# EasyEDA schematic SCH_LEDChaser_2025-10-19.json

## Sheets
1 Sheet_1: TITLE: Sheet_1; REV: 1.0; Date: 2025-10-19; Sheet: 1/1; Drawn By: cqnl; Company: Your Company
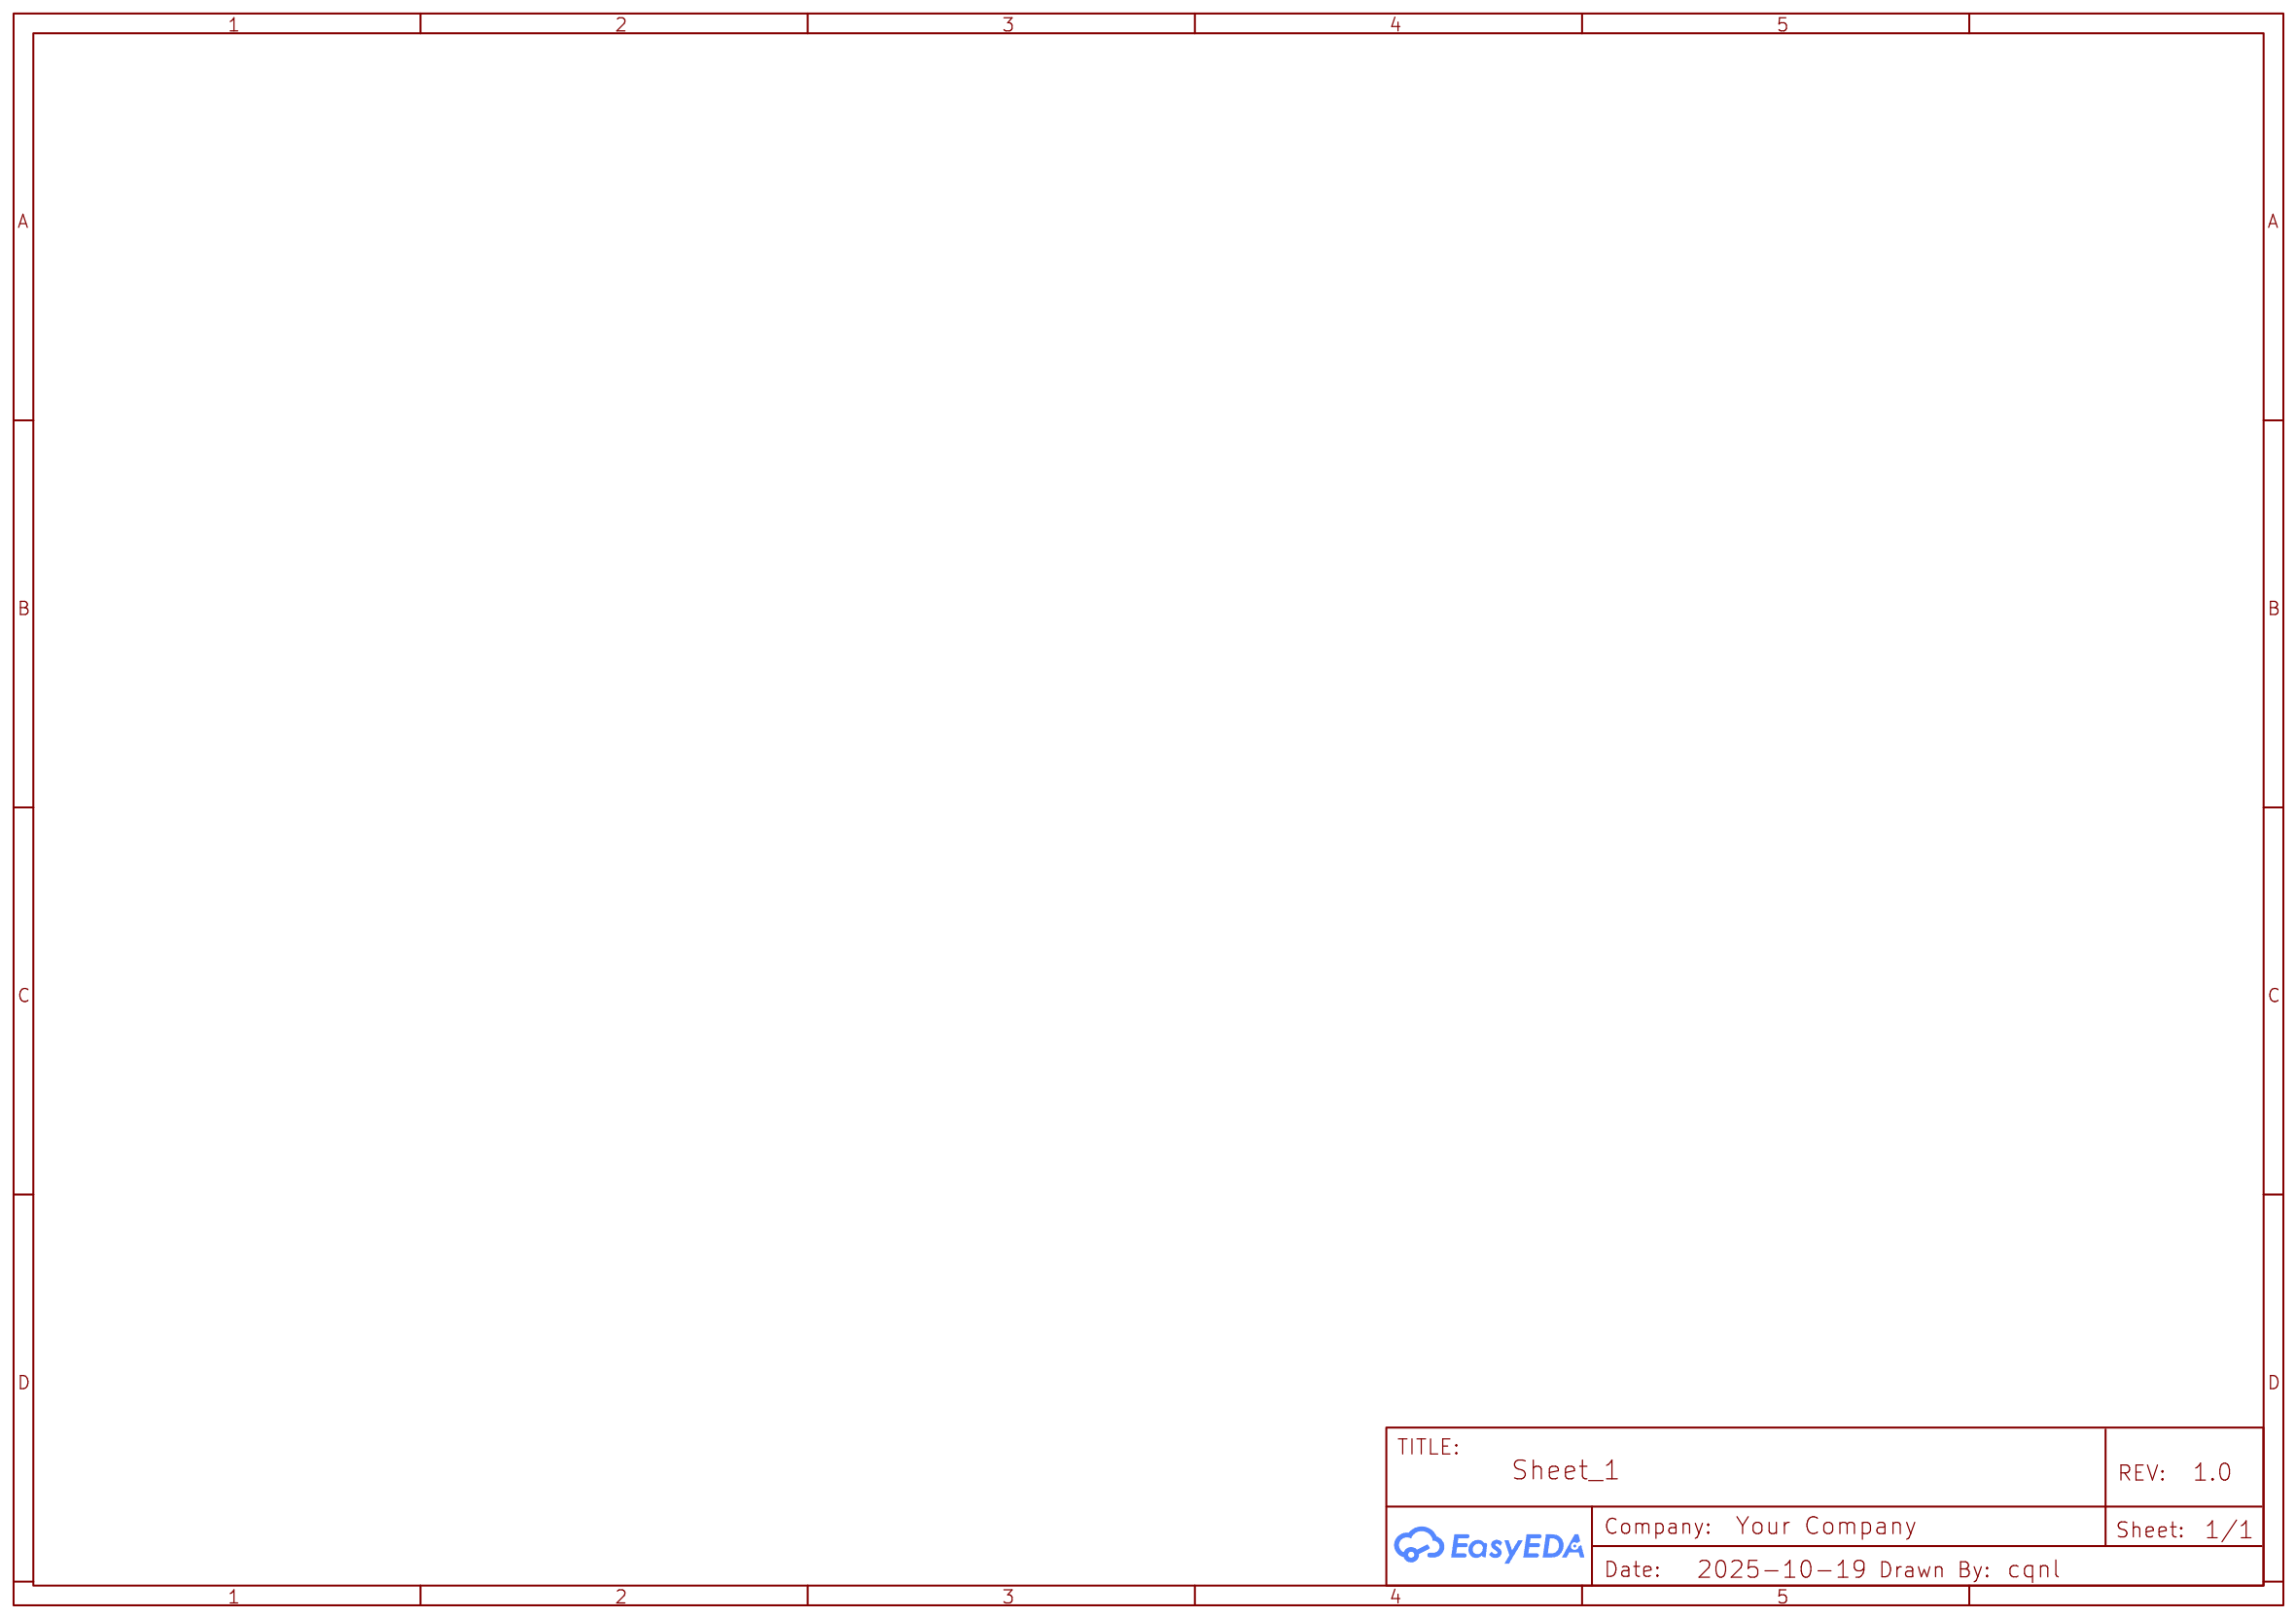
[diagram p0: Sheet_1]
2 LED Lab Components: Date: 2025-02-25; Drawn By: johncohnvt
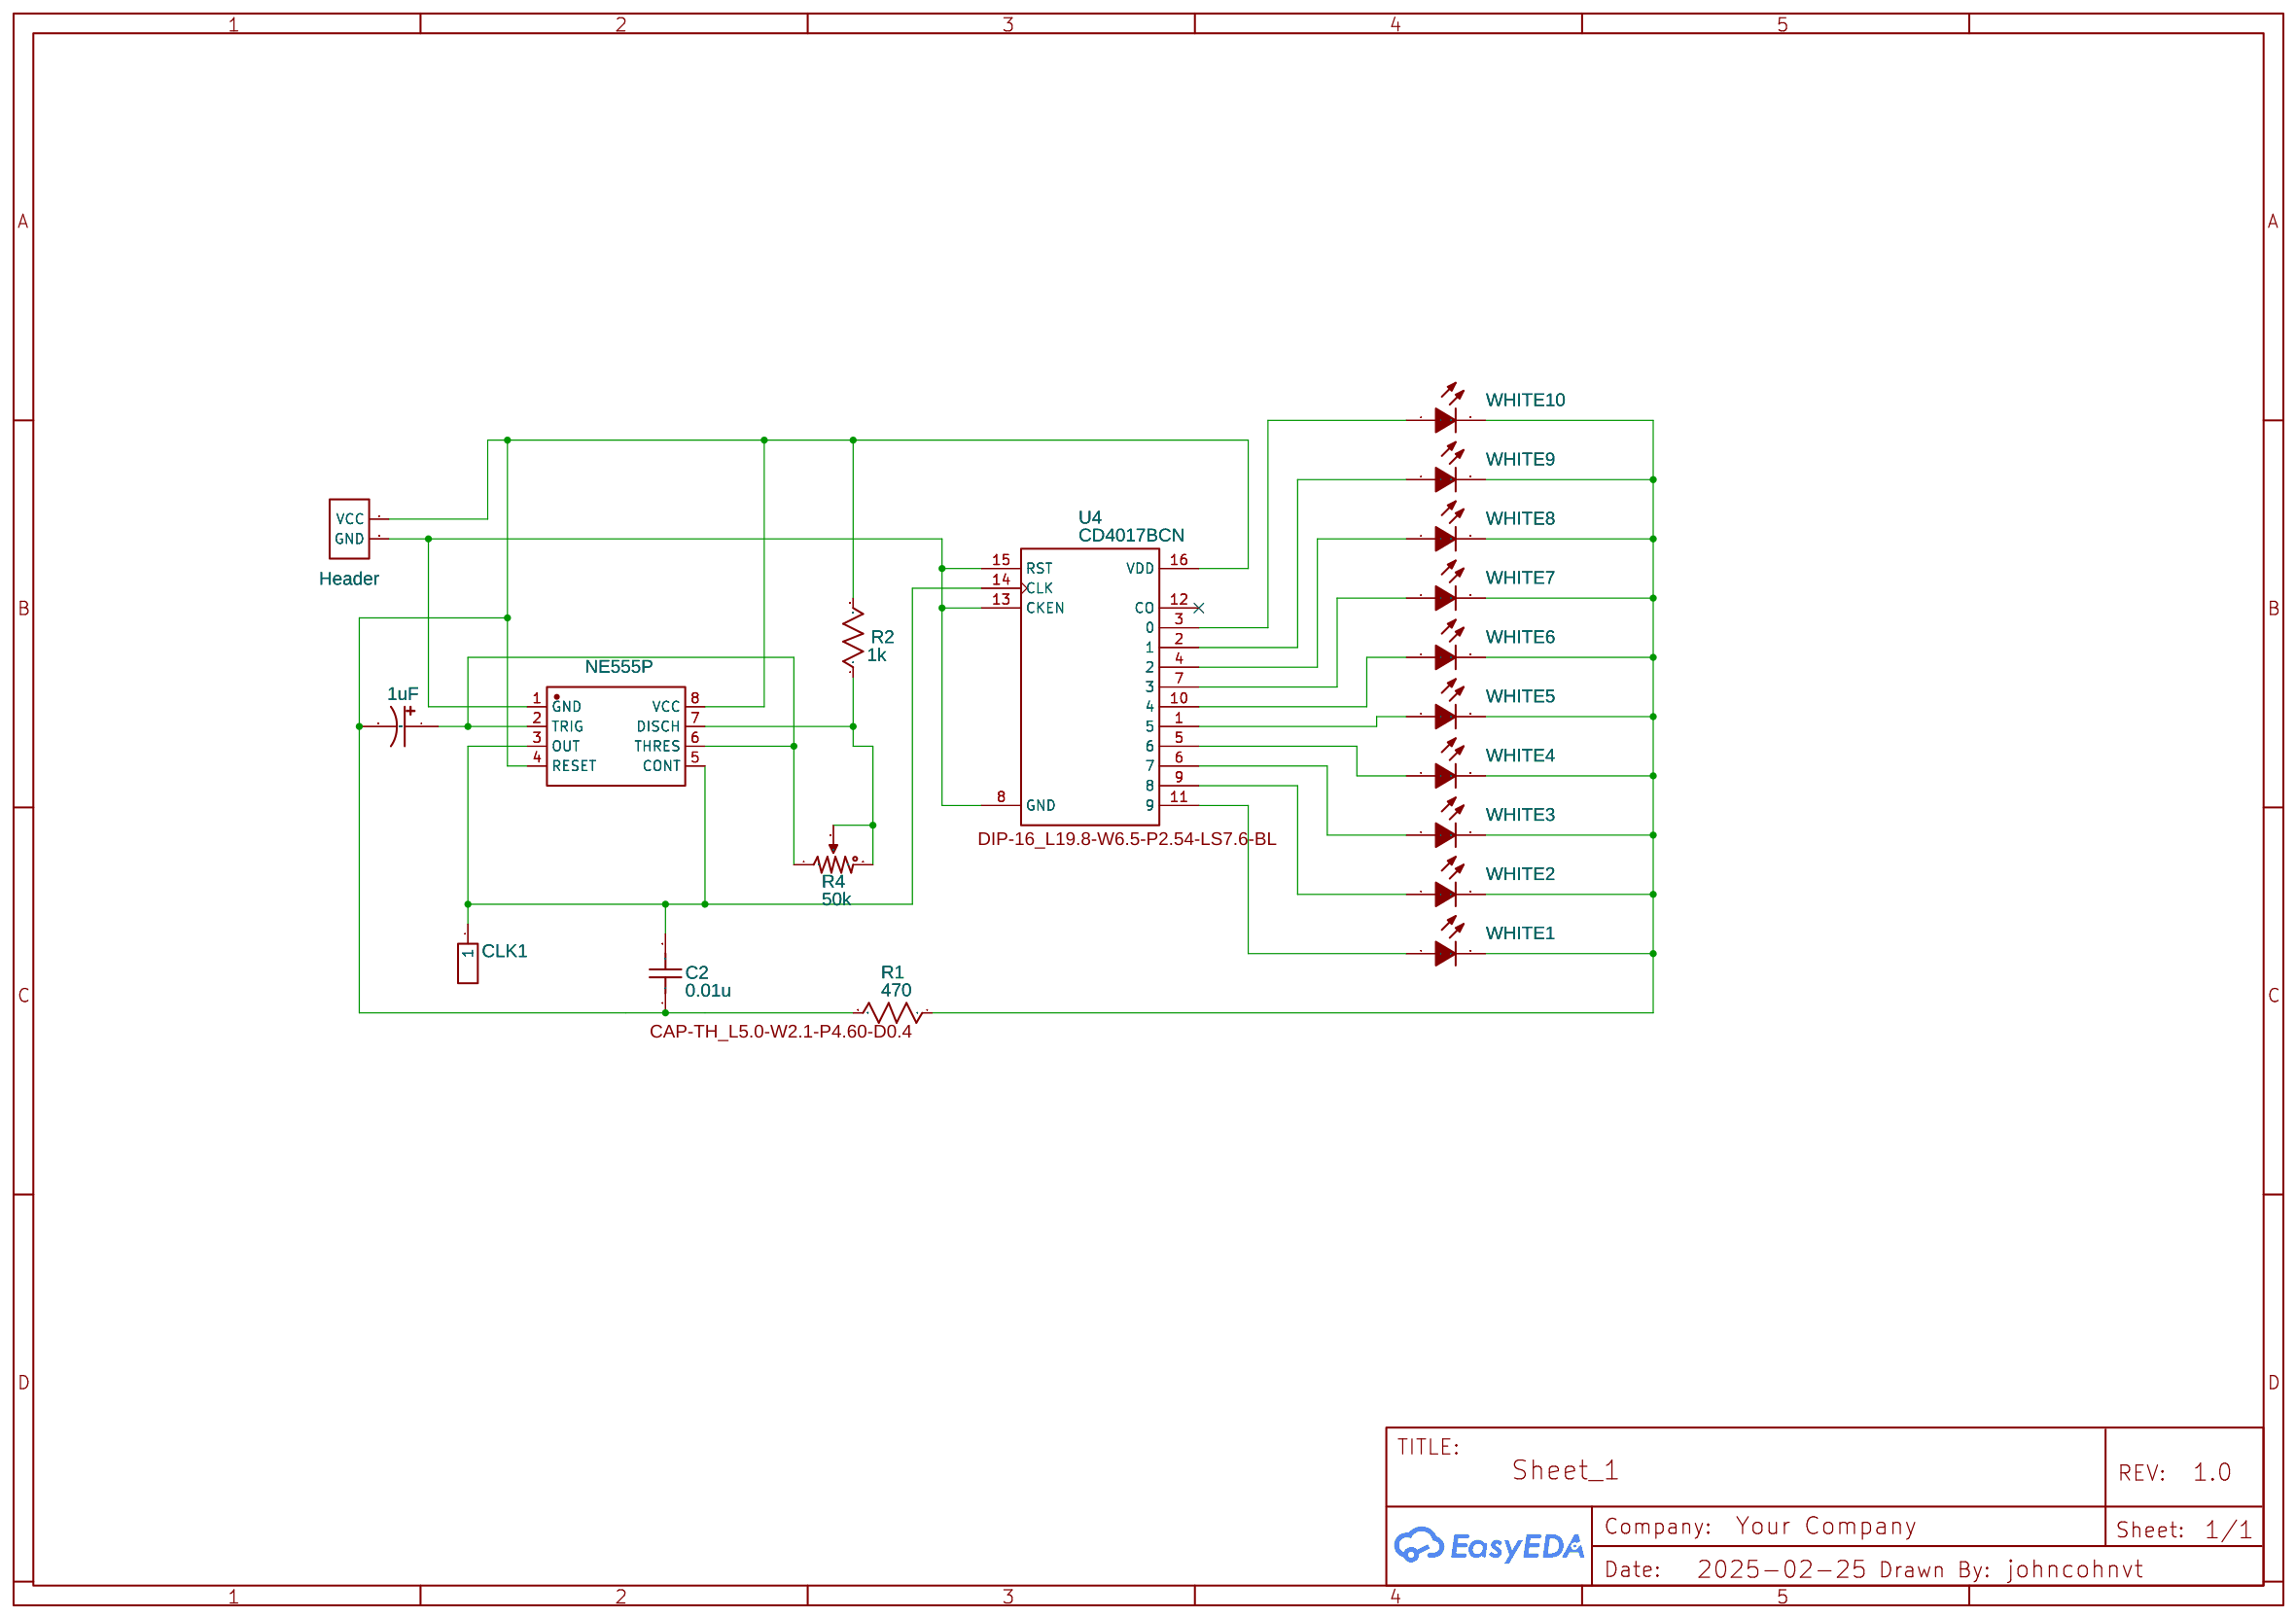
[diagram p1: LED Lab Components]

## Parts
C1  1uF  [CAP-TH_BD5.0-P2.00-D0.8-FD]
C2  0.01u  [CAP-TH_L5.0-W2.1-P4.60-D0.4]
CLK1  C81276  [HDR-TH_1P-P2.54-V-M]
H1  Header  [HDR-M-2.54_1X2]
R1  470  [R_AXIAL-0.3]
R2  1k  [R_AXIAL-0.3]
R4  50k  [RES-ADJ-3296X]
U2  NE555P  [DIP-8_L9.8-W6.6-P2.54-LS7.6-BL]
U4  CD4017BCN  [DIP-16_L19.8-W6.5-P2.54-LS7.6-BL]
WHITE1  LED_5MM  [LED-TH_BD5.0-P2.54-FD_C9900023552]
WHITE2  LED_5MM  [LED-TH_BD5.0-P2.54-FD_C9900023552]
WHITE3  LED_5MM  [LED-TH_BD5.0-P2.54-FD_C9900023552]
WHITE4  LED_5MM  [LED-TH_BD5.0-P2.54-FD_C9900023552]
WHITE5  LED_5MM  [LED-TH_BD5.0-P2.54-FD_C9900023552]
WHITE6  LED_5MM  [LED-TH_BD5.0-P2.54-FD_C9900023552]
WHITE7  LED_5MM  [LED-TH_BD5.0-P2.54-FD_C9900023552]
WHITE8  LED_5MM  [LED-TH_BD5.0-P2.54-FD_C9900023552]
WHITE9  LED_5MM  [LED-TH_BD5.0-P2.54-FD_C9900023552]
WHITE10  LED_5MM  [LED-TH_BD5.0-P2.54-FD_C9900023552]

## Library data of the parts
C1 = UVZ1H010MDD: Contributor: LCSC; Supplier: LCSC; Supplier Part: C62934; Manufacturer: Nichicon(尼吉康)
C2 = C_0603_US: Supplier Part: C249157; Supplier: LCSC; Contributor: LCEDA_Lib; Package Display: Yes
CLK1 = Header-Male-2.54_1x1: Supplier: LCSC; Manufacturer Part: 2.54-1*1P针; JLCPCB Part Class: Extended Part; Package Display: No; Manufacturer: BOOMELE(Boom Precision Elec); Contributor: Thejo Prakash
H1 = HEADER-FEMALE-2.54_1X2: Contributor: nonstop2004; Supplier: LCSC; Supplier Part: C492401; Package Display: No
R1 = Resistor: Manufacturer Part: ?; Supplier Part: C58592; Supplier: LCSC
R2 = Resistor: Manufacturer Part: ?; Supplier Part: C713997; Supplier: LCSC
R4 = Potentiometer: K(%): 50; Manufacturer Part: ?; Supplier: LCSC; Supplier Part: C118912; Package Display: No
U2 = NE555P: Supplier: LCSC; Manufacturer: TI(德州仪器); Supplier Part: C46749; JLCPCB Part Class: Extended Part
U4 = CD4017BCN: Decade CounterDivider with 10 Decoded Outputs; Supplier: LCSC; Supplier Part: C32710674; Package Display: Yes
WHITE1-WHITE10 = LED_5MM: Contributor: lcsc; Supplier: LCSC; Supplier Part: C2895480

## Nets
Net-(C1-1): C1.1 R4.1 U2.2(TRIG) U2.6(THRES)
Net-(C1-2): C1.2 C2.1 H1.1(VCC) R1.2 R2.2 U2.4(RESET) U2.8(VCC) U4.16(VDD)
Net-(C2-2): C2.2 CLK1.1 U2.3(OUT) U2.5(CONT) U4.14(CLK)
Net-(H1-2): H1.2(GND) U2.1(GND) U4.8(GND) U4.13(CKEN) U4.15(RST)
Net-(R1-1): R1.1 WHITE1.2(K) WHITE2.2(K) WHITE3.2(K) WHITE4.2(K) WHITE5.2(K) WHITE6.2(K) WHITE7.2(K) WHITE8.2(K) WHITE9.2(K) WHITE10.2(K)
Net-(R2-1): R2.1 R4.2(3) R4.3(2) U2.7(DISCH)
Net-(U4-1): U4.1(5) WHITE5.1(A)
Net-(U4-2): U4.2(1) WHITE9.1(A)
Net-(U4-3): U4.3(0) WHITE10.1(A)
Net-(U4-4): U4.4(2) WHITE8.1(A)
Net-(U4-5): U4.5(6) WHITE4.1(A)
Net-(U4-6): U4.6(7) WHITE3.1(A)
Net-(U4-7): U4.7(3) WHITE7.1(A)
Net-(U4-9): U4.9(8) WHITE2.1(A)
Net-(U4-10): U4.10(4) WHITE6.1(A)
Net-(U4-11): U4.11(9) WHITE1.1(A)

Not connected (* = marked no-connect by the designer): U4 12(CO)*
